# Altium project EasyPlay.PrjPcb
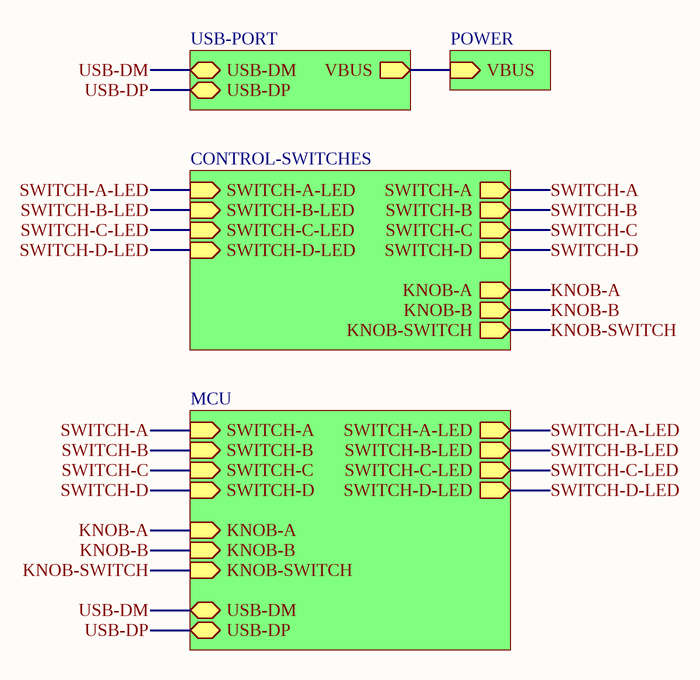
[diagram p0: OVERVIEW.SchDoc]
5 sheets, 65 parts. Net scope: hierarchical (ports join the sheet entries above them; power ports are global).
Board file: PCB.PcbDoc
Sheets:
  OVERVIEW.SchDoc
    POWER = POWER.SchDoc
    CONTROL-SWITCHES = CONTROL-SWITCHES.SchDoc
    USB-PORT = USB-PORT.SchDoc
    MCU = MCU.SchDoc

## Sheet OVERVIEW.SchDoc
size A4; SheetNumber: 1; SheetTotal: 5

### Sub-sheets
CONTROL-SWITCHES = CONTROL-SWITCHES.SchDoc: SWITCH-A-LED (in), SWITCH-B-LED (in), SWITCH-C-LED (in), SWITCH-D-LED (in), SWITCH-A (out), SWITCH-B (out), SWITCH-C (out), SWITCH-D (out), KNOB-A (out), KNOB-B (out), KNOB-SWITCH (out)
MCU = MCU.SchDoc: SWITCH-A-LED (out), SWITCH-B-LED (out), SWITCH-C-LED (out), SWITCH-D-LED (out), SWITCH-A (in), SWITCH-B (in), SWITCH-C (in), SWITCH-D (in), KNOB-A (in), KNOB-B (in), KNOB-SWITCH (in), USB-DM (bidir), USB-DP (bidir)
POWER = POWER.SchDoc: VBUS (in)
USB-PORT = USB-PORT.SchDoc: USB-DM (bidir), USB-DP (bidir), VBUS (out)

### Nets
KNOB-A: sheet CONTROL-SWITCHES/KNOB-A, sheet MCU/KNOB-A
KNOB-B: sheet CONTROL-SWITCHES/KNOB-B, sheet MCU/KNOB-B
KNOB-SWITCH: sheet CONTROL-SWITCHES/KNOB-SWITCH, sheet MCU/KNOB-SWITCH
SWITCH-A: sheet CONTROL-SWITCHES/SWITCH-A, sheet MCU/SWITCH-A
SWITCH-A-LED: sheet CONTROL-SWITCHES/SWITCH-A-LED, sheet MCU/SWITCH-A-LED
SWITCH-B: sheet CONTROL-SWITCHES/SWITCH-B, sheet MCU/SWITCH-B
SWITCH-B-LED: sheet CONTROL-SWITCHES/SWITCH-B-LED, sheet MCU/SWITCH-B-LED
SWITCH-C: sheet CONTROL-SWITCHES/SWITCH-C, sheet MCU/SWITCH-C
SWITCH-C-LED: sheet CONTROL-SWITCHES/SWITCH-C-LED, sheet MCU/SWITCH-C-LED
SWITCH-D: sheet CONTROL-SWITCHES/SWITCH-D, sheet MCU/SWITCH-D
SWITCH-D-LED: sheet CONTROL-SWITCHES/SWITCH-D-LED, sheet MCU/SWITCH-D-LED
USB-DM: sheet USB-PORT/USB-DM, sheet MCU/USB-DM
USB-DP: sheet USB-PORT/USB-DP, sheet MCU/USB-DP
VBUS: sheet POWER/VBUS, sheet USB-PORT/VBUS

## Sheet POWER.SchDoc
size A4; SheetNumber: 3; SheetTotal: 5
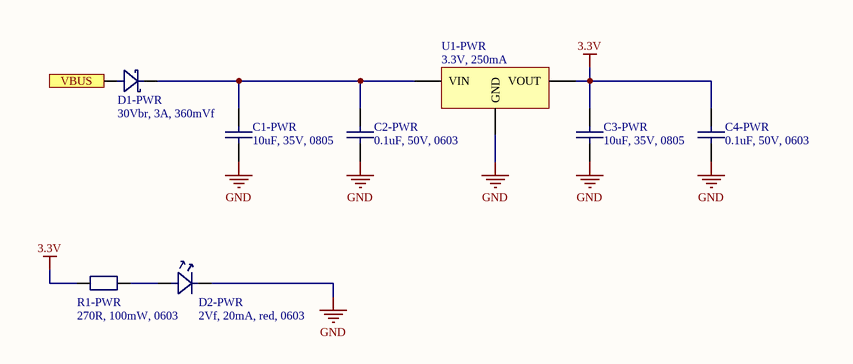
[diagram p1: POWER.SchDoc]

### Parts
C1-PWR  10uF, 35V, 0805  [0805 [2012]]
C2-PWR  0.1uF, 50V, 0603  [0603 [1608]]
C3-PWR  10uF, 35V, 0805  [0805 [2012]]
C4-PWR  0.1uF, 50V, 0603  [0603 [1608]]
D1-PWR  30Vbr, 3A, 360mVf  [SOD-128]
D2-PWR  2Vf, 20mA, red, 0603  [LED 0603 [1608]]
R1-PWR  270R, 100mW, 0603  [0603 [1608]]
U1-PWR  3.3V, 250mA  [SOT-23-3]

### Ports
VBUS (in, see OVERVIEW[2A], USB-PORT[1A])

### Nets
3.3V: C3-PWR.1 C4-PWR.2 R1-PWR.2 U1-PWR.2(VOUT)
GND: C1-PWR.2 C2-PWR.1 C3-PWR.2 C4-PWR.1 D2-PWR.1 U1-PWR.1(GND)
VBUS: D1-PWR.2 ; port VBUS
NetC1-PWR_1: C1-PWR.1 C2-PWR.2 D1-PWR.1 U1-PWR.3(VIN)
NetD2-PWR_2: D2-PWR.2 R1-PWR.1

### Library data of the parts
C1-PWR C3-PWR = Capacitor: Manufacturer: MURATA; Manufacturer ID: GRM21BR6YA106KE43L; Supplier: Farnell; Supplier ID: 2611943; URL: https://ee.farnell.com/murata/grm21br6ya106ke43l/cap-10-f-35v-10-x5r-0805/dp/2611943
C2-PWR C4-PWR = Capacitor: Manufacturer: MULTICOMP PRO; Manufacturer ID: MC0603B104J500CT; Supplier: Farnell; Supplier ID: 2320803; URL: https://ee.farnell.com/multicomp/mc0603b104j500ct/cap-0-1-f-50v-5-x7r-0603/dp/2320803?st=100%20nf
D1-PWR = Schottky Rectifier (Diode): Manufacturer: NEXPERIA; Manufacturer ID: PMEG3030EP,115; Supplier: Farnell; Supplier ID: 1829195; URL: https://ee.farnell.com/nexperia/pmeg3030ep-115/diode-schottky-rec-30v-3a-sod128/dp/1829195
D2-PWR = LED: Manufacturer: VISHAY; Manufacturer ID: VLMS1300-GS08; Supplier: Farnell; Supplier ID: 2251484; URL: https://ee.farnell.com/vishay/vlms1300-gs08/led-0603-red/dp/2251484?st=led
R1-PWR = Resistor: Manufacturer: YAGEO; Manufacturer ID: RC0603FR-07270RL; Supplier: Farnell; Supplier ID: 9238417; URL: https://ee.farnell.com/yageo/rc0603fr-07270rl/res-270r-1-0-1w-0603-thick-film/dp/9238417
U1-PWR = LDO Regulator: Fixed LDO Voltage Regulator, 2.3V to 6V, 178mV Dropout, 3.3Vout, 250mAout, SOT-23-3; Manufacturer: Microchip; Manufacturer ID: MCP1700T-3302E/TT; Supplier: Farnell; Supplier ID: 1296592; URL: https://ee.farnell.com/microchip/mcp1700t-3302e-tt/ic-v-reg-ldo-250ma-smd-sot-23/dp/1296592?st=3.3

## Sheet CONTROL-SWITCHES.SchDoc
size A4; SheetNumber: 2; SheetTotal: 5
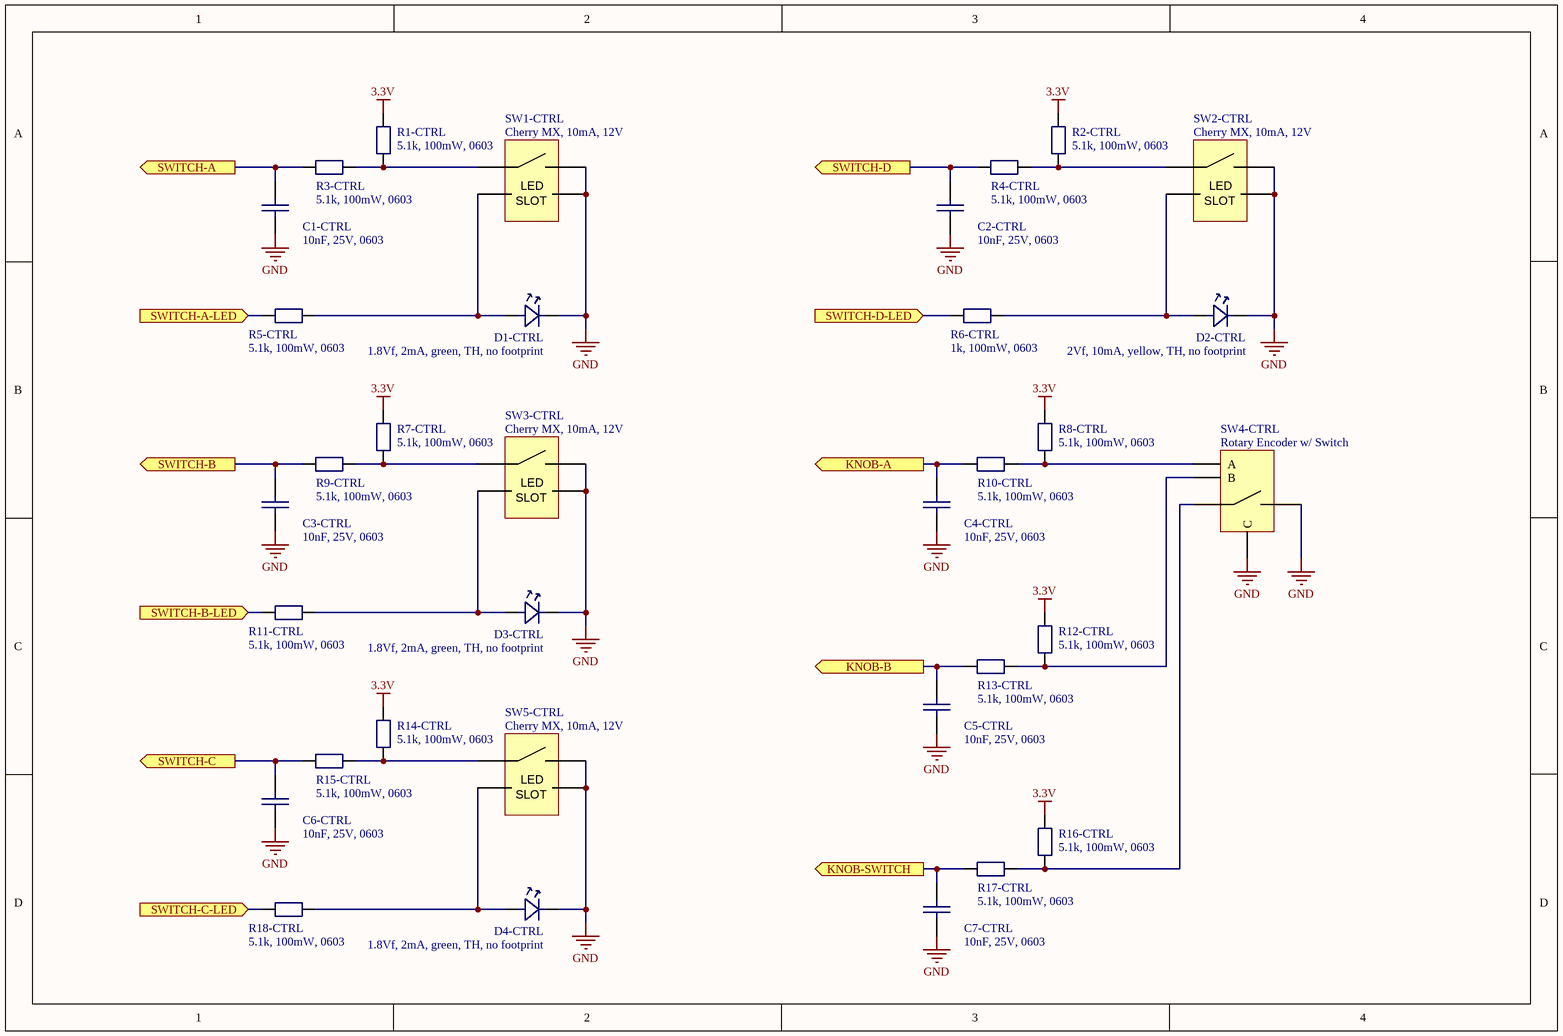
[diagram p2: CONTROL-SWITCHES.SchDoc]

### Parts
C1-CTRL  10nF, 25V, 0603  [0603 [1608]]
C2-CTRL  10nF, 25V, 0603  [0603 [1608]]
C3-CTRL  10nF, 25V, 0603  [0603 [1608]]
C4-CTRL  10nF, 25V, 0603  [0603 [1608]]
C5-CTRL  10nF, 25V, 0603  [0603 [1608]]
C6-CTRL  10nF, 25V, 0603  [0603 [1608]]
C7-CTRL  10nF, 25V, 0603  [0603 [1608]]
D1-CTRL  1.8Vf, 2mA, green, TH, no footprint  [LED 0603 [1608]]  (mechanical)
D2-CTRL  2Vf, 10mA, yellow, TH, no footprint  [LED 0603 [1608]]  (mechanical)
D3-CTRL  1.8Vf, 2mA, green, TH, no footprint  [LED 0603 [1608]]  (mechanical)
D4-CTRL  1.8Vf, 2mA, green, TH, no footprint  [LED 0603 [1608]]  (mechanical)
R1-CTRL  5.1k, 100mW, 0603  [0603 [1608]]
R2-CTRL  5.1k, 100mW, 0603  [0603 [1608]]
R3-CTRL  5.1k, 100mW, 0603  [0603 [1608]]
R4-CTRL  5.1k, 100mW, 0603  [0603 [1608]]
R5-CTRL  5.1k, 100mW, 0603  [0603 [1608]]
R6-CTRL  1k, 100mW, 0603  [0603 [1608]]
R7-CTRL  5.1k, 100mW, 0603  [0603 [1608]]
R8-CTRL  5.1k, 100mW, 0603  [0603 [1608]]
R9-CTRL  5.1k, 100mW, 0603  [0603 [1608]]
R10-CTRL  5.1k, 100mW, 0603  [0603 [1608]]
R11-CTRL  5.1k, 100mW, 0603  [0603 [1608]]
R12-CTRL  5.1k, 100mW, 0603  [0603 [1608]]
R13-CTRL  5.1k, 100mW, 0603  [0603 [1608]]
R14-CTRL  5.1k, 100mW, 0603  [0603 [1608]]
R15-CTRL  5.1k, 100mW, 0603  [0603 [1608]]
R16-CTRL  5.1k, 100mW, 0603  [0603 [1608]]
R17-CTRL  5.1k, 100mW, 0603  [0603 [1608]]
R18-CTRL  5.1k, 100mW, 0603  [0603 [1608]]
SW1-CTRL  Cherry MX, 10mA, 12V  [Cherry MX Switch]
SW2-CTRL  Cherry MX, 10mA, 12V  [Cherry MX Switch]
SW3-CTRL  Cherry MX, 10mA, 12V  [Cherry MX Switch]
SW4-CTRL  Rotary Encoder w/ Switch  [Rotary Encoder w/ Switch (Bourns)]
SW5-CTRL  Cherry MX, 10mA, 12V  [Cherry MX Switch]

### Ports
KNOB-A (out, see OVERVIEW[2B], MCU[1B]), KNOB-B (out, see OVERVIEW[2B], MCU[1A]), KNOB-SWITCH (out, see OVERVIEW[2B], MCU[1A]), SWITCH-A (out, see OVERVIEW[2A], MCU[1A]), SWITCH-A-LED (in, see OVERVIEW[1A], MCU[1A]), SWITCH-B (out, see OVERVIEW[2A], MCU[1A]), SWITCH-B-LED (in, see OVERVIEW[1A], MCU[1A]), SWITCH-C (out, see OVERVIEW[2A], MCU[1A]), SWITCH-C-LED (in, see OVERVIEW[1A], MCU[1A]), SWITCH-D (out, see OVERVIEW[2A], MCU[2A]), SWITCH-D-LED (in, see OVERVIEW[1A], MCU[2A])

### Nets
3.3V: R1-CTRL.2 R2-CTRL.2 R7-CTRL.2 R8-CTRL.2 R12-CTRL.2 R14-CTRL.2 R16-CTRL.2
GND: C1-CTRL.1 C2-CTRL.1 C3-CTRL.1 C4-CTRL.1 C5-CTRL.1 C6-CTRL.1 C7-CTRL.1 D1-CTRL.1 D2-CTRL.1 D3-CTRL.1 D4-CTRL.1 SW1-CTRL.2 SW1-CTRL.4 SW2-CTRL.2 SW2-CTRL.4 SW3-CTRL.2 SW3-CTRL.4 SW4-CTRL.2 SW4-CTRL.C SW5-CTRL.2 SW5-CTRL.4
KNOB-A: C4-CTRL.2 R10-CTRL.2 ; port KNOB-A
KNOB-B: C5-CTRL.2 R13-CTRL.2 ; port KNOB-B
KNOB-SWITCH: C7-CTRL.2 R17-CTRL.2 ; port KNOB-SWITCH
SWITCH-A: C1-CTRL.2 R3-CTRL.2 ; port SWITCH-A
SWITCH-A-LED: R5-CTRL.1 ; port SWITCH-A-LED
SWITCH-B: C3-CTRL.2 R9-CTRL.2 ; port SWITCH-B
SWITCH-B-LED: R11-CTRL.1 ; port SWITCH-B-LED
SWITCH-C: C6-CTRL.2 R15-CTRL.2 ; port SWITCH-C
SWITCH-C-LED: R18-CTRL.1 ; port SWITCH-C-LED
SWITCH-D: C2-CTRL.2 R4-CTRL.2 ; port SWITCH-D
SWITCH-D-LED: R6-CTRL.1 ; port SWITCH-D-LED
NetD1-CTRL_2: D1-CTRL.2 R5-CTRL.2 SW1-CTRL.3
NetD2-CTRL_2: D2-CTRL.2 R6-CTRL.2 SW2-CTRL.3
NetD3-CTRL_2: D3-CTRL.2 R11-CTRL.2 SW3-CTRL.3
NetD4-CTRL_2: D4-CTRL.2 R18-CTRL.2 SW5-CTRL.3
NetR1-CTRL_1: R1-CTRL.1 R3-CTRL.1 SW1-CTRL.1
NetR2-CTRL_1: R2-CTRL.1 R4-CTRL.1 SW2-CTRL.1
NetR7-CTRL_1: R7-CTRL.1 R9-CTRL.1 SW3-CTRL.1
NetR8-CTRL_1: R8-CTRL.1 R10-CTRL.1 SW4-CTRL.A
NetR12-CTRL_1: R12-CTRL.1 R13-CTRL.1 SW4-CTRL.B
NetR14-CTRL_1: R14-CTRL.1 R15-CTRL.1 SW5-CTRL.1
NetR16-CTRL_1: R16-CTRL.1 R17-CTRL.1 SW4-CTRL.1

### Notes on the sheet
- (in symbol Cherry MX Switch) LED; SLOT

### Library data of the parts
C1-CTRL C2-CTRL C3-CTRL C4-CTRL C5-CTRL C6-CTRL C7-CTRL = Capacitor: Manufacturer: YAGEO; Manufacturer ID: CC0603KRX7R8BB103; Supplier: Farnell; Supplier ID: 3019561; URL: https://ee.farnell.com/yageo/cc0603krx7r8bb103/cap-0-01-f-25v-10-x7r-0603/dp/3019561
D1-CTRL D3-CTRL D4-CTRL = LED: Manufacturer: MULTICOMP PRO; Manufacturer ID: MP008246; Supplier: Farnell; Supplier ID: 3796272; URL: https://ee.farnell.com/multicomp-pro/mp008246/led-green-1-5mcd-572nm-3mm/dp/3796272?st=led%203mm
D2-CTRL = LED: Manufacturer: BROADCOM; Manufacturer ID: HLMP-1401; Supplier: Farnell; Supplier ID: 1003198; URL: https://ee.farnell.com/broadcom-limited/hlmp-1401/led-3mm-yellow-2-2mcd-585nm/dp/1003198
R1-CTRL R2-CTRL R3-CTRL R4-CTRL R5-CTRL R7-CTRL R8-CTRL R9-CTRL R10-CTRL R11-CTRL R12-CTRL R13-CTRL R14-CTRL R15-CTRL R16-CTRL R17-CTRL R18-CTRL = Resistor: Manufacturer: YAGEO; Manufacturer ID: RC0603FR-075K1L; Supplier: Farnell; Supplier ID: 3495881; URL: https://ee.farnell.com/yageo/rc0603fr-075k1l/res-5k1-1-0-1w-0603-thick-film/dp/3495881
R6-CTRL = Resistor: Manufacturer: KOA; Manufacturer ID: RK73H1JTTD1001F.; Supplier: Farnell; Supplier ID: 3548613; URL: https://ee.farnell.com/koa-speer-electronics/rk73h1jttd1001f/res-1k-1-0-125w-0603/dp/3548613
SW1-CTRL SW2-CTRL SW3-CTRL SW5-CTRL = Cherry MX Switch: Manufacturer: Cherry Americas LLC; Manufacturer ID: MX1A-11NW; Supplier: Digi-Key; Supplier ID: CH160-ND; URL: https://www.digikey.ee/en/products/detail/cherry-americas-llc/MX1A-11NW/91134
SW4-CTRL = Rotary Encoder w/ Switch: Manufacturer: Bourns; Manufacturer ID: PEC11H-4015F-S0016; Supplier: Digi-Key; Supplier ID: 118-PEC11H-4015F-S0016-ND; URL: https://www.digikey.ee/en/products/detail/bourns-inc/PEC11H-4015F-S0016/12349530

## Sheet USB-PORT.SchDoc
size A4; SheetNumber: 4; SheetTotal: 5
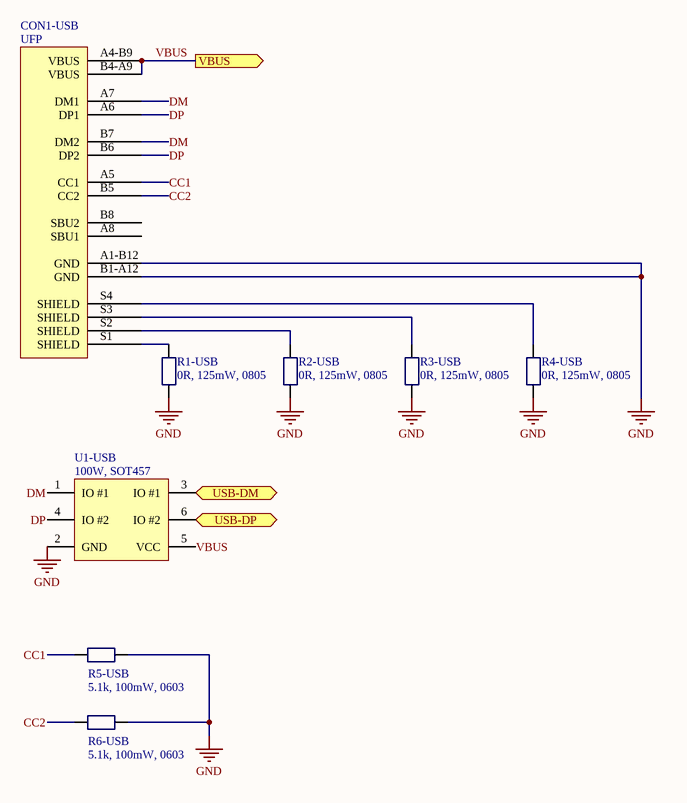
[diagram p3: USB-PORT.SchDoc]

### Parts
CON1-USB  UFP  [Molex USB Type-C]
R1-USB  0R, 125mW, 0805  [0805 [2012]]
R2-USB  0R, 125mW, 0805  [0805 [2012]]
R3-USB  0R, 125mW, 0805  [0805 [2012]]
R4-USB  0R, 125mW, 0805  [0805 [2012]]
R5-USB  5.1k, 100mW, 0603  [0603 [1608]]
R6-USB  5.1k, 100mW, 0603  [0603 [1608]]
U1-USB  100W, SOT457  [SOT457]

### Ports
USB-DM (bidir, see OVERVIEW[1A], MCU[1B]), USB-DP (bidir, see OVERVIEW[1A], MCU[1B]), VBUS (out, see OVERVIEW[2A], POWER[1A])

### Nets
GND: CON1-USB.A1-B12(GND) CON1-USB.B1-A12(GND) R1-USB.2 R2-USB.2 R3-USB.2 R4-USB.2 R5-USB.1 R6-USB.1 U1-USB.2(GND)
CC1: CON1-USB.A5(CC1) R5-USB.2
CC2: CON1-USB.B5(CC2) R6-USB.2
DM: CON1-USB.A7(DM1) CON1-USB.B7(DM2) U1-USB.1(IO_#1)
DP: CON1-USB.A6(DP1) CON1-USB.B6(DP2) U1-USB.4(IO_#2)
USB-DM: U1-USB.3(IO_#1) ; port USB-DM
USB-DP: U1-USB.6(IO_#2) ; port USB-DP
VBUS: CON1-USB.A4-B9(VBUS) CON1-USB.B4-A9(VBUS) U1-USB.5(VCC) ; port VBUS
NetCON1-USB_S1: CON1-USB.S1(SHIELD) R1-USB.1
NetCON1-USB_S2: CON1-USB.S2(SHIELD) R2-USB.1
NetCON1-USB_S3: CON1-USB.S3(SHIELD) R3-USB.1
NetCON1-USB_S4: CON1-USB.S4(SHIELD) R4-USB.1

Not connected (* = marked no-connect by the designer): CON1-USB A8(SBU1) B8(SBU2)

### Library data of the parts
CON1-USB = Molex USB 2.0 Type-C Receptacle: USB Connector, USB Type C, USB 2.0, Receptacle, 16 Ways, Surface Mount, Right Angle; Manufacturer: MOLEX; Manufacturer ID: 216990-0003; Supplier: Farnell; Supplier ID: 3702962; URL: https://ee.farnell.com/molex/216990-0003/conector-usb-2-0-tipo-c-hembra/dp/3702962
R1-USB R2-USB R3-USB R4-USB = Resistor: Manufacturer: MULTICOMP PRO; Manufacturer ID: MC0805S8F0000T5E; Supplier: Farnell; Supplier ID: 2309112; URL: https://ee.farnell.com/multicomp/mc0805s8f0000t5e/res-0r0-1-0-125w-0805-thick-film/dp/2309112
R5-USB R6-USB = Resistor: as R1-CTRL on sheet CONTROL-SWITCHES; Supplier: Farnell; Supplier ID: 3495881; URL: https://ee.farnell.com/yageo/rc0603fr-075k1l/res-5k1-1-0-1w-0603-thick-film/dp/3495881
U1-USB = ESD Protection Device: Manufacturer: NEXPERIA; Manufacturer ID: IP4234CZ6,125; Supplier: Farnell; Supplier ID: 1829276; URL: https://ee.farnell.com/nexperia/ip4234cz6-125/diode-esd-tvs-usb2-0-sot457/dp/1829276

## Sheet MCU.SchDoc
size A4; SheetNumber: 5; SheetTotal: 5
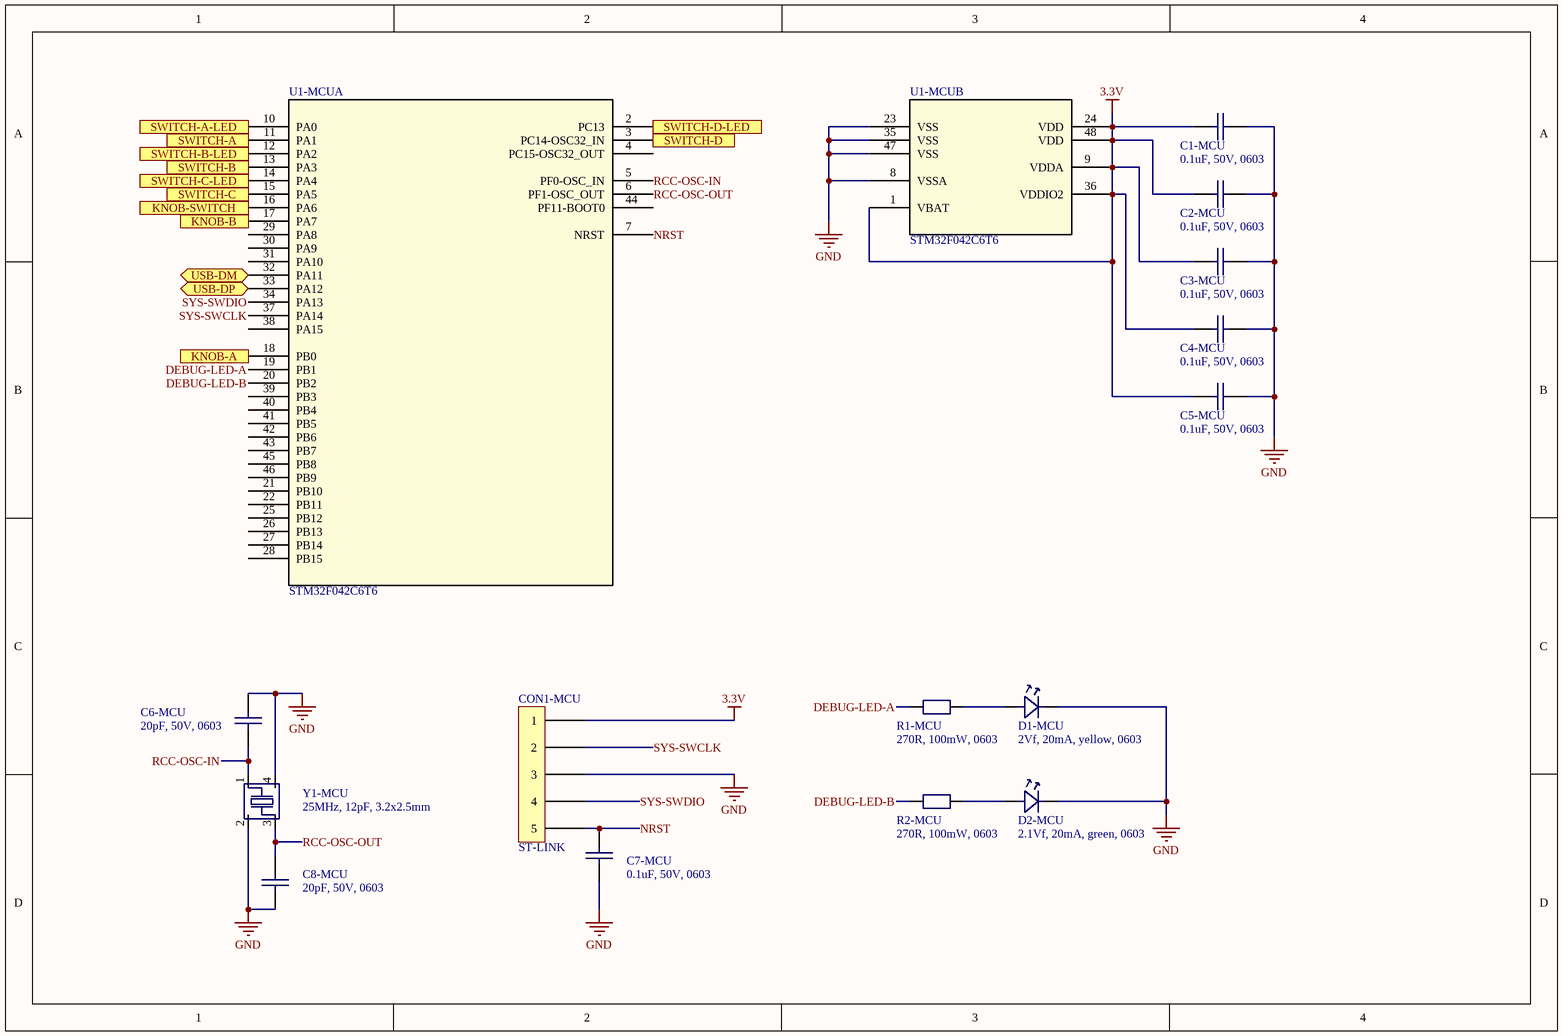
[diagram p4: MCU.SchDoc]

### Parts
C1-MCU  0.1uF, 50V, 0603  [0603 [1608]]
C2-MCU  0.1uF, 50V, 0603  [0603 [1608]]
C3-MCU  0.1uF, 50V, 0603  [0603 [1608]]
C4-MCU  0.1uF, 50V, 0603  [0603 [1608]]
C5-MCU  0.1uF, 50V, 0603  [0603 [1608]]
C6-MCU  20pF, 50V, 0603  [0603 [1608]]
C7-MCU  0.1uF, 50V, 0603  [0603 [1608]]
C8-MCU  20pF, 50V, 0603  [0603 [1608]]
CON1-MCU  ST-LINK  [5x1 Pin Header (TH)]
D1-MCU  2Vf, 20mA, yellow, 0603  [LED 0603 [1608]]
D2-MCU  2.1Vf, 20mA, green, 0603  [LED 0603 [1608]]
R1-MCU  270R, 100mW, 0603  [0603 [1608]]
R2-MCU  270R, 100mW, 0603  [0603 [1608]]
U1-MCU  STM32F042C6T6  [LQFP48]  (parts A,B of 2)
Y1-MCU  25MHz, 12pF, 3.2x2.5mm  [Crystal 3.2x2.5mm]

### Ports
KNOB-A (in, see OVERVIEW[1B], CONTROL-SWITCHES[3B]), KNOB-B (in, see OVERVIEW[1B], CONTROL-SWITCHES[3C]), KNOB-SWITCH (in, see OVERVIEW[1B], CONTROL-SWITCHES[3D]), SWITCH-A (in, see OVERVIEW[1B], CONTROL-SWITCHES[1A]), SWITCH-A-LED (out, see OVERVIEW[2B], CONTROL-SWITCHES[1B]), SWITCH-B (in, see OVERVIEW[1B], CONTROL-SWITCHES[1B]), SWITCH-B-LED (out, see OVERVIEW[2B], CONTROL-SWITCHES[1C]), SWITCH-C (in, see OVERVIEW[1B], CONTROL-SWITCHES[1C]), SWITCH-C-LED (out, see OVERVIEW[2B], CONTROL-SWITCHES[1D]), SWITCH-D (in, see OVERVIEW[1B], CONTROL-SWITCHES[3A]), SWITCH-D-LED (out, see OVERVIEW[2B], CONTROL-SWITCHES[3B]), USB-DM (bidir, see OVERVIEW[1B], USB-PORT[1C]), USB-DP (bidir, see OVERVIEW[1B], USB-PORT[1C])

### Nets
3.3V: C1-MCU.1 C2-MCU.1 C3-MCU.1 C4-MCU.1 C5-MCU.1 CON1-MCU.1 U1-MCU.1(VBAT) U1-MCU.9(VDDA) U1-MCU.24(VDD) U1-MCU.36(VDDIO2) U1-MCU.48(VDD)
GND: C1-MCU.2 C2-MCU.2 C3-MCU.2 C4-MCU.2 C5-MCU.2 C6-MCU.1 C7-MCU.2 C8-MCU.2 CON1-MCU.3 D1-MCU.1 D2-MCU.1 U1-MCU.8(VSSA) U1-MCU.23(VSS) U1-MCU.35(VSS) U1-MCU.47(VSS) Y1-MCU.2 Y1-MCU.4
DEBUG-LED-A: R1-MCU.2 U1-MCU.19(PB1)
DEBUG-LED-B: R2-MCU.2 U1-MCU.20(PB2)
KNOB-A: U1-MCU.18(PB0) ; port KNOB-A
KNOB-B: U1-MCU.17(PA7) ; port KNOB-B
KNOB-SWITCH: U1-MCU.16(PA6) ; port KNOB-SWITCH
NRST: C7-MCU.1 CON1-MCU.5 U1-MCU.7(NRST)
RCC-OSC-IN: C6-MCU.2 U1-MCU.5(PF0-OSC_IN) Y1-MCU.1
RCC-OSC-OUT: C8-MCU.1 U1-MCU.6(PF1-OSC_OUT) Y1-MCU.3
SWITCH-A: U1-MCU.11(PA1) ; port SWITCH-A
SWITCH-A-LED: U1-MCU.10(PA0) ; port SWITCH-A-LED
SWITCH-B: U1-MCU.13(PA3) ; port SWITCH-B
SWITCH-B-LED: U1-MCU.12(PA2) ; port SWITCH-B-LED
SWITCH-C: U1-MCU.15(PA5) ; port SWITCH-C
SWITCH-C-LED: U1-MCU.14(PA4) ; port SWITCH-C-LED
SWITCH-D: U1-MCU.3(PC14-OSC32_IN) ; port SWITCH-D
SWITCH-D-LED: U1-MCU.2(PC13) ; port SWITCH-D-LED
SYS-SWCLK: CON1-MCU.2 U1-MCU.37(PA14)
SYS-SWDIO: CON1-MCU.4 U1-MCU.34(PA13)
USB-DM: U1-MCU.32(PA11) ; port USB-DM
USB-DP: U1-MCU.33(PA12) ; port USB-DP
NetD1-MCU_2: D1-MCU.2 R1-MCU.1
NetD2-MCU_2: D2-MCU.2 R2-MCU.1

Not connected (* = marked no-connect by the designer): U1-MCU 4(PC15-OSC32_OUT) 21(PB10) 22(PB11) 25(PB12) 26(PB13) 27(PB14) 28(PB15) 29(PA8) 30(PA9) 31(PA10) 38(PA15) 39(PB3) 40(PB4) 41(PB5) 42(PB6) 43(PB7) 44(PF11-BOOT0) 45(PB8) 46(PB9)

### Library data of the parts
C1-MCU C2-MCU C3-MCU C4-MCU C5-MCU C7-MCU = Capacitor: as C2-PWR on sheet POWER; Supplier: Farnell; Supplier ID: 2320803; URL: https://ee.farnell.com/multicomp/mc0603b104j500ct/cap-0-1-f-50v-5-x7r-0603/dp/2320803?st=100%20nf
C6-MCU C8-MCU = Capacitor: Manufacturer: MULTICOMP PRO; Manufacturer ID: MC0603N200J500CT; Supplier: Farnell; Supplier ID: 2627461; URL: https://ee.farnell.com/multicomp/mc0603n200j500ct/cap-20pf-50v-5-c0g-np0-0603/dp/2627461
CON1-MCU = 5x1 Pin Header: Manufacturer: AMPHENOL; Manufacturer ID: 68000-105HLF; Supplier: Farnell; Supplier ID: 2751380; URL: https://ee.farnell.com/amphenol-icc-fci/68000-105hlf/connector-header-5pos-1row-2-54mm/dp/2751380
D1-MCU = LED: Manufacturer: KINGBRIGHT; Manufacturer ID: KP-1608SYC; Supplier: Farnell; Supplier ID: 8529841; URL: https://ee.farnell.com/kingbright/kp-1608syc/led-0-8mm-x-1-2mm-yellow-80mcd/dp/8529841
D2-MCU = LED: Manufacturer: KINGBRIGHT; Manufacturer ID: KP-1608CGCK; Supplier: Farnell; Supplier ID: 2290328; URL: https://ee.farnell.com/kingbright/kp-1608cgck/led-0603-50mcd-green/dp/2290328
R1-MCU R2-MCU = Resistor: as R1-PWR on sheet POWER; Supplier: Farnell; Supplier ID: 9238417; URL: https://ee.farnell.com/yageo/rc0603fr-07270rl/res-270r-1-0-1w-0603-thick-film/dp/9238417
U1-MCU = STM32F042C6T6 (MCU): Manufacturer: STMicroelectronics; Manufacturer ID: STM32F042C6T6; Supplier: JLCPCB; Supplier ID: C88447; URL: https://jlcpcb.com/partdetail/Stmicroelectronics-STM32F042C6T6/C88447
Y1-MCU = Crystal 4-pin: Manufacturer: MULTICOMP PRO; Manufacturer ID: MCSJK-7U-25.00-12-10-60-B-10; Supplier: Farnell; Supplier ID: 2853968; URL: https://ee.farnell.com/multicomp/mcsjk-7u-25-00-12-10-60-b-10/crystal-25mhz-12pf-3-2mm-x-2-5mm/dp/2853968?st=mcsjk-7u-25.00-12-10-60-b-10

## Nets that join several sheets
3.3V: POWER (C3-PWR.1 C4-PWR.2 R1-PWR.2 U1-PWR.2), CONTROL-SWITCHES (7 pins), MCU (11 pins)
GND: POWER (6 pins), CONTROL-SWITCHES (21 pins), USB-PORT (9 pins), MCU (17 pins)
KNOB-A: CONTROL-SWITCHES (C4-CTRL.2 R10-CTRL.2), MCU (U1-MCU.18)
KNOB-B: CONTROL-SWITCHES (C5-CTRL.2 R13-CTRL.2), MCU (U1-MCU.17)
KNOB-SWITCH: CONTROL-SWITCHES (C7-CTRL.2 R17-CTRL.2), MCU (U1-MCU.16)
SWITCH-A: CONTROL-SWITCHES (C1-CTRL.2 R3-CTRL.2), MCU (U1-MCU.11)
SWITCH-A-LED: CONTROL-SWITCHES (R5-CTRL.1), MCU (U1-MCU.10)
SWITCH-B: CONTROL-SWITCHES (C3-CTRL.2 R9-CTRL.2), MCU (U1-MCU.13)
SWITCH-B-LED: CONTROL-SWITCHES (R11-CTRL.1), MCU (U1-MCU.12)
SWITCH-C: CONTROL-SWITCHES (C6-CTRL.2 R15-CTRL.2), MCU (U1-MCU.15)
SWITCH-C-LED: CONTROL-SWITCHES (R18-CTRL.1), MCU (U1-MCU.14)
SWITCH-D: CONTROL-SWITCHES (C2-CTRL.2 R4-CTRL.2), MCU (U1-MCU.3)
SWITCH-D-LED: CONTROL-SWITCHES (R6-CTRL.1), MCU (U1-MCU.2)
USB-DM: USB-PORT (U1-USB.3), MCU (U1-MCU.32)
USB-DP: USB-PORT (U1-USB.6), MCU (U1-MCU.33)
VBUS: POWER (D1-PWR.2), USB-PORT (CON1-USB.A4-B9 CON1-USB.B4-A9 U1-USB.5)